# EAGLE design Qwiic Joystick (EAGLE 9.2.0)
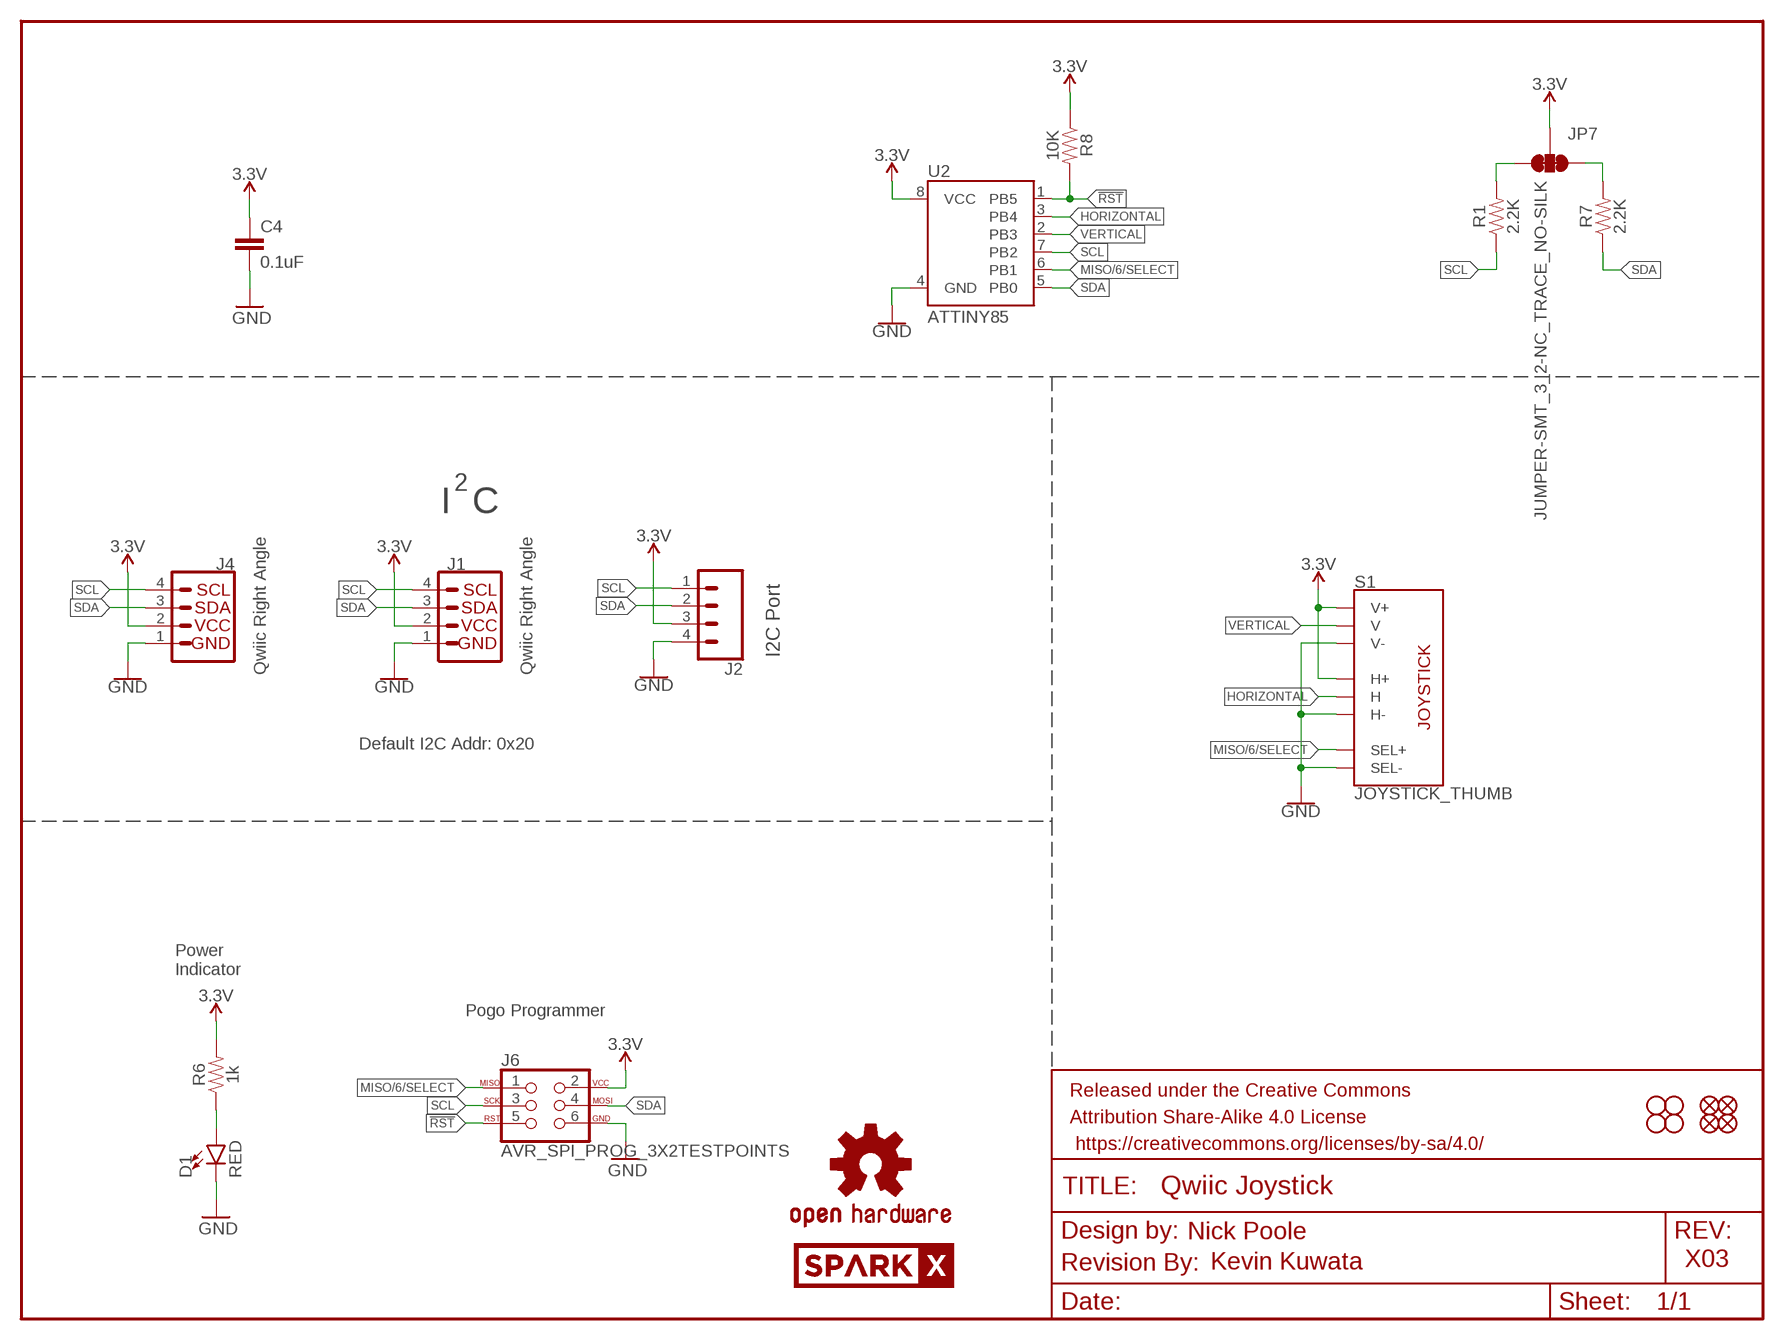
[diagram p0: schematic, sheet 1]

## Parts
C4  0.1uF  0.1UF-0603-25V-(+80/-20%)  [0603]
D1  RED  LED-RED0603  [LED-0603]
FRAME1  FRAME-LETTER  [CREATIVE_COMMONS]
H1  STAND-OFF  [STAND-OFF]
H2  STAND-OFF  [STAND-OFF]
H3  STAND-OFF  [STAND-OFF]
H4  STAND-OFF  [STAND-OFF]
J1  Qwiic Right Angle  I2C_STANDARDQWIIC  [1X04_1MM_RA]
J2  CONN_041X04_NO_SILK  [1X04_NO_SILK]
J4  Qwiic Right Angle  I2C_STANDARDQWIIC  [1X04_1MM_RA]
J6  AVR_SPI_PROG_3X2TESTPOINTS  [2X3_TEST_POINTS]
JP1  FIDUCIALUFIDUCIAL  [MICRO-FIDUCIAL]
JP2  FIDUCIALUFIDUCIAL  [MICRO-FIDUCIAL]
JP3  FIDUCIALUFIDUCIAL  [MICRO-FIDUCIAL]
JP6  FIDUCIALUFIDUCIAL  [MICRO-FIDUCIAL]
JP7  JUMPER-SMT_3_2-NC_TRACE_NO-SILK  [SMT-JUMPER_3_2-NC_TRACE_NO-SILK]
LOGO1  OSHW-LOGOMINI  [OSHW-LOGO-MINI]
LOGO2  REVISION  [REVISION]
R1  2.2K  4.7KOHM-0603-1/10W-1%  [0603]
R6  1k  1KOHM-0603-1/10W-1%  [0603]
R7  2.2K  4.7KOHM-0603-1/10W-1%  [0603]
R8  10K  330OHM-0603-1/10W-1%  [0603]
S1  JOYSTICK_THUMB  [JOYSTICK]
U2  ATTINY85  [ATTINY85]
U$1  SPARKX-LOGO3  [SPARKX-SMALL]
U$2  SPARKX-LOGO3  [SPARKX-SMALL]

## Nets
3.3V: C4.1 J1.2 J2.3 J4.2 J6.2 JP7.2 R6.2 R8.1 S1.H1(H+) S1.V1(V+) U2.8(VCC)
!RST: J6.5 R8.2 U2.1(PB5)
GND: C4.2 D1.C J1.1 J2.4 J4.1 J6.6 S1.B2A(SEL-) S1.H3(H-) S1.V3(V-) U2.4(GND)
HORIZONTAL: S1.H2(H) U2.3(PB4)
MISO/6/SELECT: J6.1 S1.B1A(SEL+) U2.6(PB1)
N$1: D1.A R6.1
N$2: JP7.1 R7.2
N$3: JP7.3 R1.2
SCL: J1.4 J2.1 J4.4 J6.3 R1.1 U2.7(PB2)
SDA: J1.3 J2.2 J4.3 J6.4 R7.1 U2.5(PB0)
VERTICAL: S1.V2(V) U2.2(PB3)

## Notes on the sheet
- 2
- I  C
- I2C Port
- Default I2C Addr: 0x20
- Power
  Indicator
- Pogo Programmer
- Nick Poole
- Kevin Kuwata | X03

## Library data of the parts
C4 = SparkFun-Capacitors:0.1UF: 0.1µF ceramic capacitors A capacitor is a passive two-terminal electrical component used to store electrical energy temporarily in an electric field.; PROD_ID: CAP-00810
D1 = SparkFun-LED:LED-RED: Red SMD LED Used in manufacturing of most products at SparkFun Packages: 0603 - SMD 0603 package [Product Link] <http://docs.avagotech.com/docs/AV02-0551EN> 0603 SMART - SMD 0603 SMART package ( more efficient and expensive)[Product Link] <http://www.osram-os.com/Graphics/XPic2/00077099_0.pdf> 1206 - SMD1206 package [Product Link] <https://www.sparkfun.com/datasheets/DevTools/LilyPad/Q150OVS4.pdff> SparkFun Products: Pro Mini 328 -5V <https://www.sparkfun.com/products/821> RedBoard <https://www.sparkfun.com/products/12757> IOIO-OTG <https://www.sparkfun.com/products/13613>; PROD_ID: DIO-00819
FRAME1 = SparkFun-Aesthetics:FRAME-LETTER: Schematic Frame - Letter Standard 8.5x11 US Letter frame
H1-H4 = SparkFun-Hardware:STAND-OFF: Stand Off Drill holes for mechanically mounting via screws, standoffs, etc. Note: Use the keepout ring to avoid running the screw head into surrounding components. Variant Overviews STAND-OFF - Mechanical footprint for a #4 phillips button head screw. STAND-OFF-TIGHT - Mechanical footprint for a #4 phillips button head screw, Example SparkFun Products Screw - Phillips Head (1/4", 4-40, 10 pack) <https://www.sparkfun.com/products/10453> (PRT-10453) Screw - Phillips Head (1/2", 4-40, 10 pack) <https://www.sparkfun.com/products/10452> (PRT-10452) Screw - Phillips Head (3/4", 4-40, 10 pack) <https://www.sparkfun.com/products/10451> (PRT-10451) Screw - Phillips Head (1", 4-40, 10 pack) <https://www.sparkfun.com/products/10450> (PRT-10450)
J1 J4 = SparkFun-Connectors:I2C_STANDARD: SparkFun I2C Standard Pinout Header SparkFun has standardized on a pinout for all I2C based sensor breakouts. This pinout allows I2C boards to be plugged directly into the headers on Arduino Uno compatible boards, and to be daisy chained easily. Example SparkFun Products: SparkFun Atmospheric Sensor Breakout - BME280 <https://www.sparkfun.com/products/13676> SparkFun Altitude/Pressure Sensor Breakout - MPL3115A2 <https://www.sparkfun.com/products/11084> SparkFun TOF Range Finder Sensor - VL6180 <https://www.sparkfun.com/products/12785>; PROD_ID: CONN-13694
J2 = SparkFun-Connectors:CONN_04: Multi connection point. Often used as Generic Header-pin footprint for 0.1 inch spaced/style header connections On any of the 0.1 inch spaced packages, you can populate with these: Break Away Headers - Straight <https://www.sparkfun.com/products/116> (PRT-00116) Break Away Male Headers - Right Angle <https://www.sparkfun.com/products/553> (PRT-00553) Female Headers <https://www.sparkfun.com/products/115> (PRT-00115) Break Away Headers - Machine Pin <https://www.sparkfun.com/products/117> (PRT-00117) Break Away Female Headers - Swiss Machine Pin <https://www.sparkfun.com/products/743> (PRT-00743) For SCREWTERMINALS and SPRING TERMINALS visit here: Screw Terimnals on SparkFun.com <https://www.sparkfun.com/search/results?term=Screw+Terminals> (5mm/3.5mm/2.54mm spacing) This device is also useful as a general connection point to wire up your design to another part of your project. Our various solder wires solder well into these plated through hole pads. Hook-Up Wire - Assortment (Stranded, 22 AWG) <https://www.sparkfun.com/products/11375> (PRT-11375) Hook-Up Wire - Assortment (Solid Core, 22 AWG) <https://www.sparkfun.com/products/11367> (PRT-11367) View the entire wire category on our website here <https://www.sparkfun.com/categories/141> Special notes: Molex polarized connector foot print use with SKU : PRT-08231 with associated crimp pins and housings. 1MM SMD Version SKU: PRT-10208; PROD_ID: CONN-09696
J6 = SparkFun-Connectors:AVR_SPI_PROG_3X2: AVR ISP 6 Pin This is the reduced ISP connector for AVR programming. Common on Arduino. This footprint will take up less PCB space and can be used with a 10-pin to 6-pin adapter such as SKU: BOB-08508 **Special note about "TEST_POINT" package. The stop mask is on the top side, so if you want your programming test points to be on the bottom of your board, make sure to place this package on the bottom side of the board. This also ensure that the orientation to program from the bottom side will be correct. SparkFun Products: SparkFun ISP Pogo Adapter <https://www.sparkfun.com/products/11591> - NS Tiny AVR Programmer <https://www.sparkfun.com/products/11801> -PTH
JP1-JP3 JP6 = SparkFun:FIDUCIAL: Fiducial Alignment Points Various fiducial points for machine vision alignment.
JP7 = SparkFun-Jumpers:JUMPER-SMT_3_2-NC_TRACE: Normally closed trace jumper (2 of 2 connections) This jumper has a trace between all three pads so they are normally closed (NC). Use a razor knife to open the connection(s). For best results follow the IPC guidelines for cutting traces: Cutout at least 0.063 mm (0.005 in). Remove all loose material to clean up the cut area. Seal the cut with an approved epoxy. Reapply solder to reclose the connection(s).
LOGO1 = SparkFun-Aesthetics:OSHW-LOGO: Open-Source Hardware (OSHW) Logo This logo indicates the piece of hardware it is found on incorporates a OSHW license and/or adheres to the definition of open source hardware found here: http://freedomdefined.org/OSHW
LOGO2 = SparkFun-Aesthetics:REVISION: "Revision By" Text Preceding text for revisor documentation. Includes schematic text on "symbols" layer, and board text on tDoc.
R1 R7 = SparkFun-Resistors:4.7KOHM: 4.7kΩ resistor A resistor is a passive two-terminal electrical component that implements electrical resistance as a circuit element. Resistors act to reduce current flow, and, at the same time, act to lower voltage levels within circuits. - Wikipedia; PROD_ID: RES-07857; VALUE: 4.7k
R6 = SparkFun-Resistors:1KOHM: 1kΩ resistor A resistor is a passive two-terminal electrical component that implements electrical resistance as a circuit element. Resistors act to reduce current flow, and, at the same time, act to lower voltage levels within circuits. - Wikipedia; PROD_ID: RES-07856
R8 = SparkFun-Resistors:330OHM: 330Ω resistor A resistor is a passive two-terminal electrical component that implements electrical resistance as a circuit element. Resistors act to reduce current flow, and, at the same time, act to lower voltage levels within circuits. - Wikipedia; PROD_ID: RES-00818; VALUE: 330
S1 = SparkFun-Switches:JOYSTICK_THUMB: Analog Thumb Joystick This is a joystick very similar to the ‘analog’ joysticks on PS2 (PlayStation 2) controllers. Directional movements are simply two potentiometers - one for each axis. Pots are ~10k each. This joystick also has a select button that is actuated when the joystick is pressed down. SparkFun Products Thumb Joystick <https://www.sparkfun.com/products/9032> (COM-09032) SparkFun Thumb Joystick Breakout <https://www.sparkfun.com/products/9110> (BOB-09110) SparkFun Joystick Shield Kit <https://www.sparkfun.com/products/9760> (DEV-09760); PROD_ID: COMP-09744; SF_SKU: COM-09032
U2 = SparkFun-IC-Microcontroller:ATTINY85; PROD_ID: IC-09092
U$1 U$2 = SparkX:SPARKX-LOGO

## Board
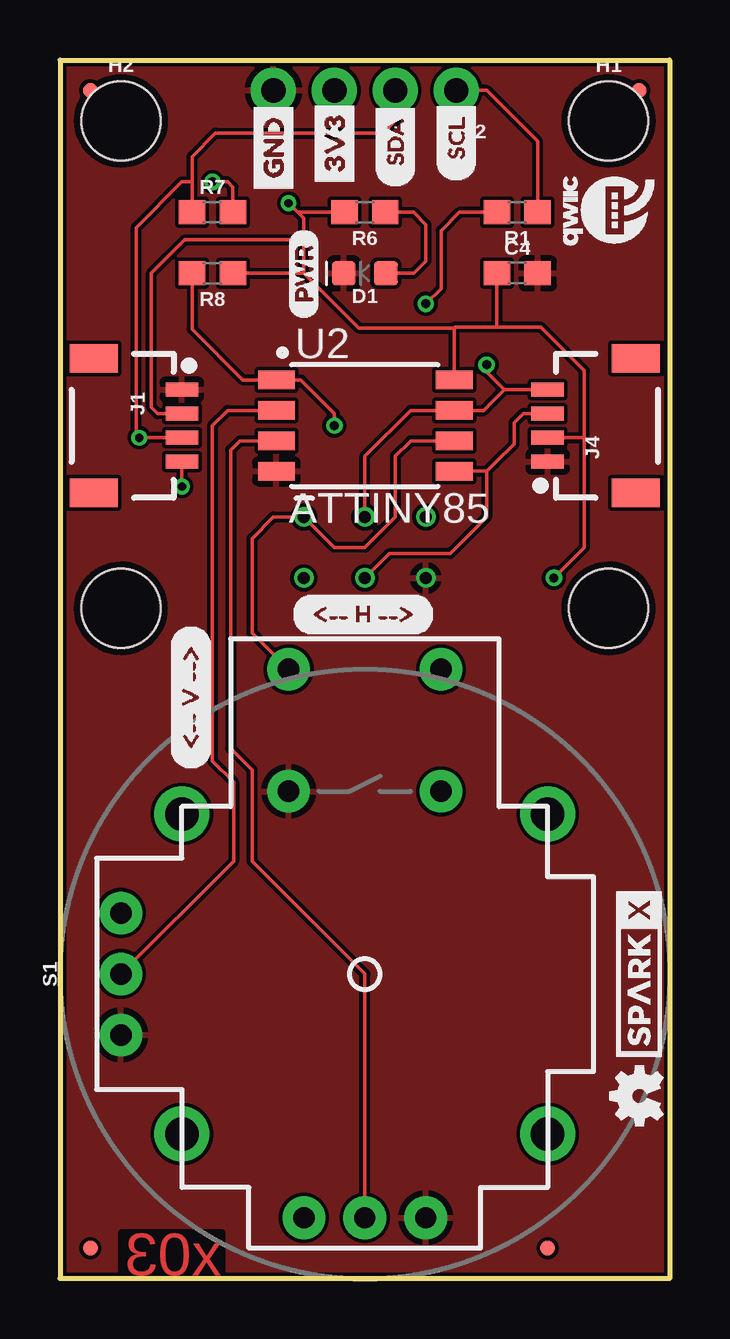
[diagram p1: board, top side]
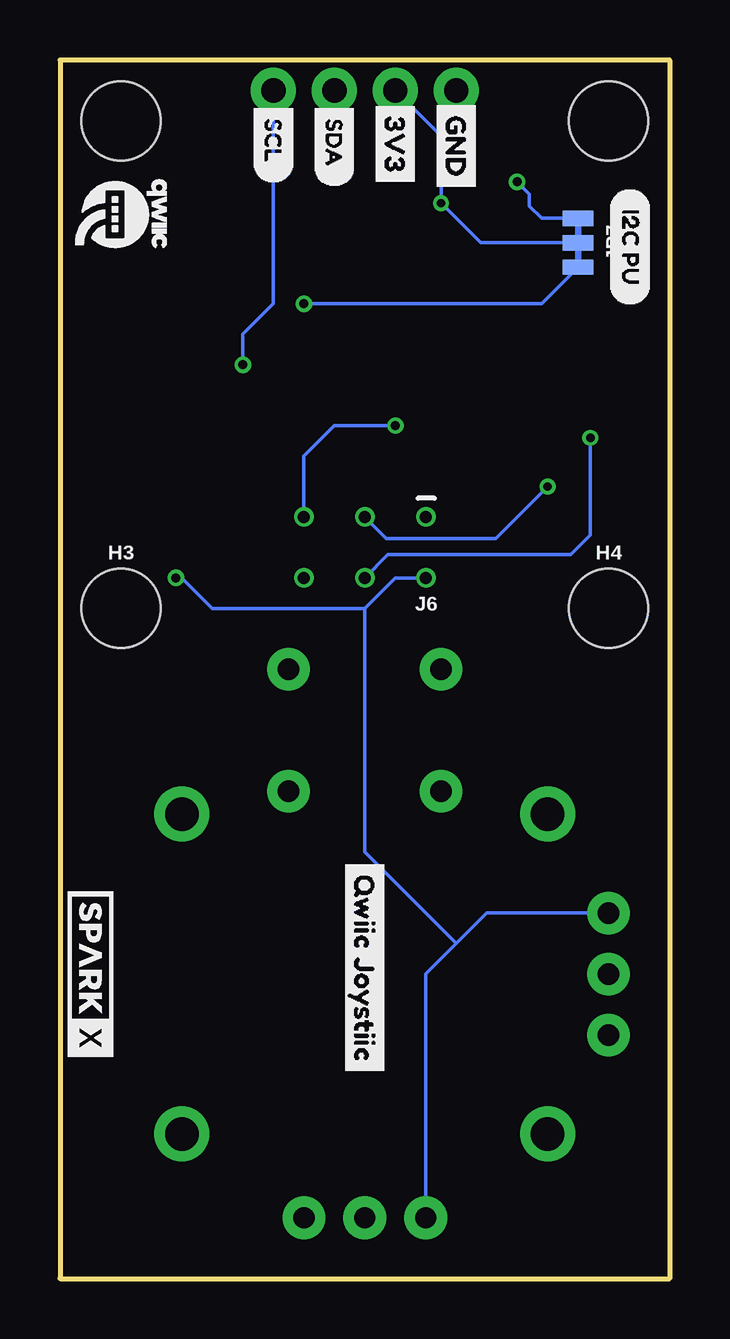
[diagram p2: board, bottom side, seen from below]

Size 25.4 x 50.8 mm. Coordinates in mm from the lower left corner, seen from the top.
Outline: 0,50.8 0,0 25.4,0 25.4,50.8 0,50.8
Copper layers (1*16): Top 0.035mm / dielectric 1.5mm / Bottom 0.035mm
Design rules "SparkFun-2-layer-PCBWay-LIMIT": minimum track width 6mil, minimum drill 0.3mm, track to track 6mil, track to pad 6mil, pad to pad 6mil, via to via 6mil, smd to smd 6mil, copper to edge 6mil, drill to drill 6mil, minimum pad ring 6mil, minimum via ring 6mil, stop-mask expansion 4mil, vias tented up to drill 25mil, thermal gap 10mil

### Footprints (pad centres in the part's own frame; a part is rotated, then mirrored left to right if it is on the bottom)
0603 = smd 1.1 x 1: 1 -0.85,0; 2 0.85,0
LED-0603 = smd 1 x 1: A -0.877,0; C 0.877,0
STAND-OFF = hole 3.302: 0,0
1X04_1MM_RA = smd 0.6 x 1.35: 1 -1.5,0; 2 -0.5,0; 3 0.5,0; 4 1.5,0 | smd 1.2 x 2: NC1 2.8,-3.675; NC2 -2.8,-3.675
1X04_NO_SILK = drill 1.016 pad 1.88: 1 0,0; 2 2.54,0; 3 5.08,0; 4 7.62,0
2X3_TEST_POINTS = drill 0.508: 1 -2.54,-1.27; 2 -2.54,1.27; 3 0,-1.27; 4 0,1.27; 5 2.54,-1.27; 6 2.54,1.27
MICRO-FIDUCIAL = smd 0.635 x 0.635: 1 0,0
SMT-JUMPER_3_2-NC_TRACE_NO-SILK = smd 0.635 x 1.27: 1 -1.016,0; 2 0,0; 3 1.016,0
JOYSTICK = drill 0.9 pad 1.778: B1A -3.175,12.7; B1B 3.175,12.7; B2A -3.175,7.62; B2B 3.175,7.62 | drill 0.889 pad 1.778: H1 -2.54,-10.16; H2 0,-10.16; H3 2.54,-10.16; V1 -10.16,2.54; V2 -10.16,0; V3 -10.16,-2.54 | drill 1.397 pad 2.286: MOUNT1 -7.62,6.668; MOUNT2 -7.62,-6.668; MOUNT3 7.62,-6.668; MOUNT4 7.62,6.668
ATTINY85 = smd 1.524 x 0.762: 1 -3.683,1.905; 2 -3.683,0.635; 3 -3.683,-0.635; 4 -3.683,-1.905; 5 3.727,-1.905; 6 3.727,-0.635; 7 3.727,0.635; 8 3.727,1.905

### Placement (x,y rotation side)
C4  19.05,41.91 0 top
D1  12.7,41.91 180 top
FRAME1  -12.7,-12.7 0 top  (outside the outline)
H1  22.86,48.26 0 top
H2  2.54,48.26 0 top
H3  22.86,27.94 0 bottom
H4  2.54,27.94 0 bottom
J1  5.08,35.56 270 top
J2  16.51,49.53 180 top
J4  20.32,35.56 90 top
J6  12.7,30.48 180 bottom
JP1  24.13,49.53 270 top
JP2  1.27,1.27 0 top
JP3  20.32,1.27 270 top
JP6  1.27,49.53 270 top
JP7  3.81,43.18 270 bottom
LOGO1  24.13,7.62 90 top
LOGO2  -13.97,-19.05 0 top  (outside the outline)
R1  19.05,44.45 180 top
R6  12.7,44.45 180 top
R7  6.35,44.45 0 top
R8  6.35,41.91 180 top
S1  12.7,12.7 0 top
U2  12.7,35.56 0 top
U$1  24.13,12.7 90 top
U$2  24.13,12.7 270 bottom
U$3  [QWIIC_JOYSTIIC6]  12.7,17.78 270 bottom
U$4  [I2C_PU0]  1.65,45.47 270 bottom
U$5  [SDA0]  13.97,49.28 270 bottom
U$6  [GND4]  8.89,44.96 90 top
U$7  [###_V_###0]  5.46,21.21 90 top
U$8  [GND4]  8.89,49.4 270 bottom
U$9  [SCL1]  16.51,49.28 270 bottom
U$10  [QWIIC-LOGO-SMALL]  22.86,44.45 270 bottom
U$11  [SCL3]  16.51,45.72 90 top
U$12  [SDA2]  13.97,45.47 90 top
U$14  [PWR-()-03]  10.16,40.01 90 top
U$15  [###_H_###1]  9.65,27.69 0 top
U$16  [3V35]  11.43,45.21 90 top
U$17  [3V35]  11.43,49.4 270 bottom
U$22  [QWIIC-LOGO-SMALL]  22.86,44.45 90 top

### Tracks (layer width: path | path; a pad name or v marks a point on that pad's centre or on a via)
3.3V  (via drill 0.35, 0.38)
  Top 0.152: 21.84,35.05 21.84,37.85 20.02,39.67 18.16,39.67 | 21.84,35.05 21.84,30.48 v20.57,29.21 | J4.2 21.84,35.06 21.84,35.05 | R6.2 9.91,44.45 v9.53,44.83 10.16,44.2 10.16,43.31 | 10.16,41.91 12.45,39.62 16.43,39.62 | J1.2 4.07,36.06 3.81,36.32 3.81,41.91 5.21,43.31 10.16,43.31 | 10.16,41.91 10.16,43.31 | 16.43,39.62 16.47,39.67 18.16,39.67 | R8.1 10.16,41.91 | C4.1 18.2,39.7 18.16,39.67 | U2.8 16.43,39.62
  Bottom 0.152: S1.V1 7.62,15.24 8.89,13.97 | 8.89,13.97 10.16,12.7 S1.H1 | 8.89,13.97 12.7,17.78 12.7,27.94 | J6.2 11.43,29.21 12.7,27.94 | 12.7,27.94 19.05,27.94 20.32,29.21 v20.57,29.21 | JP7.2 7.87,43.18 v9.53,44.83 9.53,47.62 J2.3
!RST  (via drill 0.38)
  Top 0.152: R8.2 5.5,39.59 7.62,37.47 U2.1 10.03,37.47 11.43,36.07 v11.43,35.56
  Bottom 0.152: J6.5 15.24,34.29 13.97,35.56 v11.43,35.56
GND
  pour Top: 0,0 25.4,0 25.4,50.8 0,50.8
  pour Top (isolate 0.305): 25.4,0 0,0 0,50.8 25.4,50.8
HORIZONTAL
  Top 0.152: S1.H2 12.7,12.7 8,17.4 8,21.21 7.11,22.1 7.11,34.54 7.49,34.92 U2.3
MISO/6/SELECT
  Top 0.152: S1.B1A 8,26.92 8,30.86 8.89,31.75 J6.1 11.43,30.48 12.7,30.48 13.97,31.75 13.97,34.29 14.61,34.92 U2.6
N$1
  Top 0.152: D1.A 14.73,41.91 15.24,42.42 15.24,43.94 14.73,44.45 R6.1
N$2  (via drill 0.38)
  Top 0.152: R7.2 7.2,45.51 6.99,45.72 v6.35,45.72
  Bottom 0.152: JP7.1 5.33,44.2 5.84,44.7 5.84,45.21 v6.35,45.72
N$3  (via drill 0.38)
  Top 0.152: R1.2 16.64,44.45 15.88,43.69 15.88,41.27 v15.24,40.64
  Bottom 0.152: JP7.3 5.33,40.64 v15.24,40.64
SCL  (via drill 0.35, 0.38)
  Top 0.152: J4.4 18.52,37.06 | 18.52,37.06 18.03,36.58 17.65,36.2 U2.7 14.61,36.2 12.7,34.29 J6.3 | J2.1 17.78,49.53 19.9,47.41 R1.1 | J1.4 v5.08,33.02 | 18.52,37.06 17.78,37.8 v17.78,38.1
  Bottom 0.152: J2.1 16.51,40.64 17.78,39.37 v17.78,38.1 | v5.08,33.02 7.24,30.86 11.81,30.86 J6.3
SDA  (via drill 0.35)
  Top 0.152: J4.3 19.3,36.07 18.92,35.69 18.92,34.8 18.1,33.97 17.78,33.66 | J2.2 13.97,48.26 13.46,47.75 6.48,47.75 5.5,46.77 5.5,45.72 | J1.3 v3.31,35.06 v3.3,35.05 3.17,35.18 3.17,43.81 5.08,45.72 5.5,45.72 | R7.1 5.5,45.72 | J6.4 13.72,30.23 16.26,30.23 17.78,31.75 17.78,33.66 | U2.5 17.78,33.66
  Bottom 0.152: J6.4 11.73,30.18 4.12,30.18 3.3,30.99 v3.3,35.05
VERTICAL
  Top 0.152: S1.V2 7.24,17.4 7.24,20.7 6.35,21.59 6.35,35.56 6.99,36.2 U2.2

### Text on the board
Top: x03
tDocu: Nick Poole | Kevin Kuwata